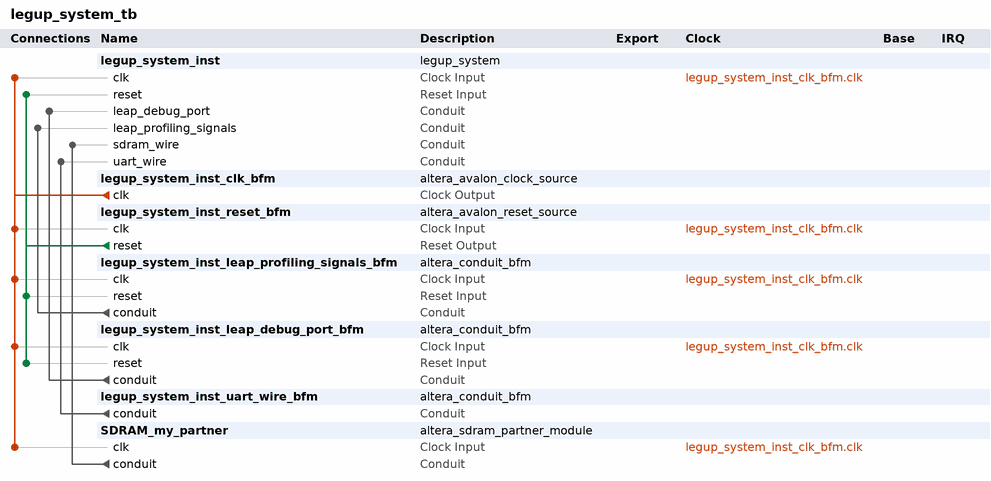
[diagram p0: system contents]
# Platform Designer (Qsys) system legup_system_tb, Cyclone II EP2C35F672C6
# Parameters at their usual value, and those the tool derives, are not listed.
package require -exact qsys 13.0
create_system legup_system_tb
set_project_property DEVICE_FAMILY {Cyclone II}
set_project_property DEVICE EP2C35F672C6

add_instance legup_system_inst legup_system 1.0

add_instance legup_system_inst_clk_bfm altera_avalon_clock_source 13.0

add_instance legup_system_inst_reset_bfm altera_avalon_reset_source 13.0
set_instance_parameter_value legup_system_inst_reset_bfm ASSERT_HIGH_RESET 0
set_instance_parameter_value legup_system_inst_reset_bfm INITIAL_RESET_CYCLES 50

add_instance legup_system_inst_leap_profiling_signals_bfm altera_conduit_bfm 13.0
set_instance_parameter_value legup_system_inst_leap_profiling_signals_bfm CLOCKED_SIGNAL true
set_instance_parameter_value legup_system_inst_leap_profiling_signals_bfm ENABLE_RESET true
set_instance_parameter_value legup_system_inst_leap_profiling_signals_bfm SIGNAL_ROLES start,end
set_instance_parameter_value legup_system_inst_leap_profiling_signals_bfm SIGNAL_WIDTHS 1,1
set_instance_parameter_value legup_system_inst_leap_profiling_signals_bfm SIGNAL_DIRECTIONS input,input

add_instance legup_system_inst_leap_debug_port_bfm altera_conduit_bfm 13.0
set_instance_parameter_value legup_system_inst_leap_debug_port_bfm CLOCKED_SIGNAL true
set_instance_parameter_value legup_system_inst_leap_debug_port_bfm ENABLE_RESET true
set_instance_parameter_value legup_system_inst_leap_debug_port_bfm SIGNAL_ROLES select,lights
set_instance_parameter_value legup_system_inst_leap_debug_port_bfm SIGNAL_WIDTHS 3,18
set_instance_parameter_value legup_system_inst_leap_debug_port_bfm SIGNAL_DIRECTIONS output,input

add_instance legup_system_inst_uart_wire_bfm altera_conduit_bfm 13.0
set_instance_parameter_value legup_system_inst_uart_wire_bfm CLOCKED_SIGNAL false
set_instance_parameter_value legup_system_inst_uart_wire_bfm ENABLE_RESET false
set_instance_parameter_value legup_system_inst_uart_wire_bfm SIGNAL_ROLES rxd,txd
set_instance_parameter_value legup_system_inst_uart_wire_bfm SIGNAL_WIDTHS 1,1
set_instance_parameter_value legup_system_inst_uart_wire_bfm SIGNAL_DIRECTIONS output,input

add_instance SDRAM_my_partner altera_sdram_partner_module 11.0
set_instance_parameter_value SDRAM_my_partner SDRAM_DATA_WIDTH 16
set_instance_parameter_value SDRAM_my_partner SDRAM_COL_WIDTH 8
set_instance_parameter_value SDRAM_my_partner SDRAM_ROW_WIDTH 12
set_instance_parameter_value SDRAM_my_partner CONTR_NAME legup_system_SDRAM

# connections
add_connection legup_system_inst_clk_bfm.clk legup_system_inst.clk clock
add_connection legup_system_inst_clk_bfm.clk legup_system_inst_leap_debug_port_bfm.clk clock
add_connection legup_system_inst_clk_bfm.clk legup_system_inst_leap_profiling_signals_bfm.clk clock
add_connection legup_system_inst_clk_bfm.clk legup_system_inst_reset_bfm.clk clock
add_connection legup_system_inst_clk_bfm.clk SDRAM_my_partner.clk clock
add_connection legup_system_inst_reset_bfm.reset legup_system_inst.reset reset
add_connection legup_system_inst_reset_bfm.reset legup_system_inst_leap_debug_port_bfm.reset reset
add_connection legup_system_inst_reset_bfm.reset legup_system_inst_leap_profiling_signals_bfm.reset reset
add_connection legup_system_inst_leap_debug_port_bfm.conduit legup_system_inst.leap_debug_port conduit
add_connection legup_system_inst_leap_profiling_signals_bfm.conduit legup_system_inst.leap_profiling_signals conduit
add_connection legup_system_inst_uart_wire_bfm.conduit legup_system_inst.uart_wire conduit
add_connection SDRAM_my_partner.conduit legup_system_inst.sdram_wire conduit

set_interconnect_requirement {$system} qsys_mm.clockCrossingAdapter HANDSHAKE
set_interconnect_requirement {$system} qsys_mm.maxAdditionalLatency 1

save_system legup_system_tb.qsys
